# EAGLE design encoder-breakout-thin (EAGLE 6.4)
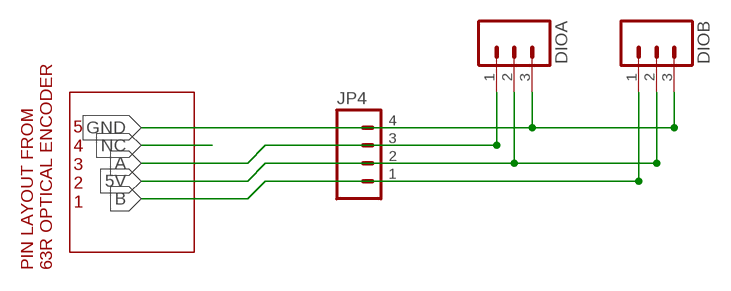
[diagram p0: schematic, sheet 1]

## Parts
DIOA  M03LOCK  [1X03_LOCK]
DIOB  M03LOCK  [1X03_LOCK]
JP4  M04LOCK  [1X04_LOCK]

## Nets
5V: DIOA.2 DIOB.2 JP4.2
A: DIOA.1 JP4.3
B: DIOB.1 JP4.1
GND: DIOA.3 DIOB.3 JP4.4

## Notes on the sheet
- 5
  4
  3
  2
  1
- PIN LAYOUT FROM
  63R OPTICAL ENCODER

## Library data of the parts
DIOA DIOB = SparkFun-Connectors:M03: Header 3 Standard 3-pin 0.1" header. Use with straight break away headers (SKU : PRT-00116), right angle break away headers (PRT-00553), swiss pins (PRT-00743), machine pins (PRT-00117), and female headers (PRT-00115). Molex polarized connector foot print use with SKU : PRT-08232 with associated crimp pins and housings.
JP4 = SparkFun-Connectors:M04: Header 4 Standard 4-pin 0.1" header. Use with straight break away headers (SKU : PRT-00116), right angle break away headers (PRT-00553), swiss pins (PRT-00743), machine pins (PRT-00117), and female headers (PRT-00115). Molex polarized connector foot print use with SKU : PRT-08231 with associated crimp pins and housings. 1MM SMD Version SKU: PRT-10208

## Board
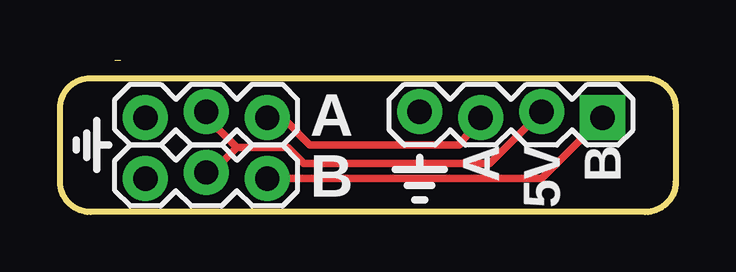
[diagram p1: board, top side]
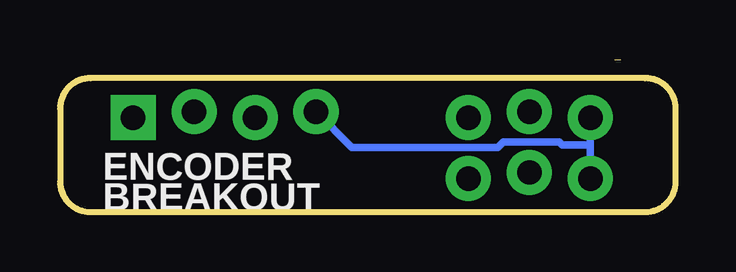
[diagram p2: board, bottom side, seen from below]

Size 25.65 x 6.35 mm. Coordinates in mm from the lower left corner, seen from the top.
Outline: 2.29,6.35 2.54,6.35
Outline: 1.27,5.59 24.38,5.59 arc-90 25.65,4.32 25.65,1.27 arc-90 24.38,0 1.27,0 arc-90 0,1.27 0,4.32 arc-90 1.27,5.59
Copper layers (1*16): Top 0.035mm / dielectric 1.5mm / Bottom 0.035mm
Design rules "default": minimum track width 10mil, minimum drill 0.6mm, track to track 8mil, track to pad 8mil, pad to pad 8mil, via to via 8mil, smd to smd 8mil, copper to edge 40mil, drill to drill 8mil, minimum pad ring 10mil, minimum via ring 8mil, stop-mask expansion 4mil, vias tented up to drill 0mil, thermal gap 10mil

### Footprints (pad centres in the part's own frame; a part is rotated, then mirrored left to right if it is on the bottom)
1X03_LOCK = drill 1.016 pad 1.88: 1 0,0.127; 2 2.54,-0.127; 3 5.08,0.127
1X04_LOCK = drill 1.016 pad 1.88 square: 1 0,0.127 | drill 1.016 pad 1.88: 2 2.54,-0.127; 3 5.08,0.127; 4 7.62,-0.127

### Placement (x,y rotation side)
DIOA  8.64,4.06 180 top
DIOB  8.64,1.52 180 top
JP4  22.61,4.06 180 top

### Tracks (layer width: path | path; a pad name or v marks a point on that pad's centre or on a via)
5V
  Top 0.305: JP4.2 17.91,2.03 10.16,2.03 9.5,2.69 7.37,2.69 | 7.37,2.69 6.33,1.65 DIOB.2 | 7.37,2.69 6.1,3.96 DIOA.2
A
  Top 0.305: JP4.3 16.64,2.79 10.41,2.79 9.4,3.81 DIOA.1
B
  Top 0.305: JP4.1 20.07,1.4 DIOB.1
GND
  Bottom 0.305: 3.56,2.79 DIOA.3 3.83,3.94 | 3.56,2.79 DIOB.3 | JP4.4 13.49,2.69 7.42,2.69 7.19,2.92 4.85,2.92 4.72,2.79 3.56,2.79

### Text on the board
tPlace: A | A | 5V | B | B
bPlace: ENCODER / BREAKOUT